# Altium schematic sheet 1-2199298-2.SchDoc
size A; SheetNumber: 1; SheetTotal: 1
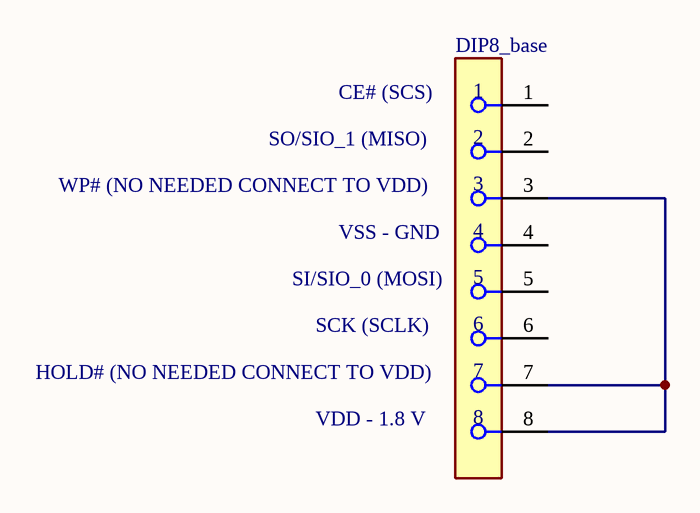
[diagram p0: 1-2199298-2.SchDoc]

## Parts
DIP8_base  DIP8_base  [FP-1-2199298-2-MFG]  (value not drawn)

## Nets
NetDIP8_base_3: DIP8_base.3 DIP8_base.7 DIP8_base.8

Not connected (* = marked no-connect by the designer): DIP8_base 1 2 4 5 6

## Notes on the sheet
- WP# (NO NEEDED CONNECT TO VDD)
- (near DIP8_base) SO/SIO_1 (MISO)
- (near DIP8_base) CE# (SCS)
- (near DIP8_base) SI/SIO_0 (MOSI)
- (near DIP8_base) VSS - GND
- HOLD# (NO NEEDED CONNECT TO VDD)
- (near DIP8_base) VDD - 1.8 V
- (near DIP8_base) SCK (SCLK)

## Library data of the parts
DIP8_base = CMP-03370-000009-1: CONN IC DIP SOCKET 8POS TIN; Contact Post Length: 3inch; Number of Contacts: 8; Contact Current Rating: 1A; Contact Resistance: 20mR; Insulation Resistance: 1GR; Connector Type: Pin; Row Spacing: 0.3inch; Pitch: 2.54mm; Mating Alignment: Yes (With); RoHS Compliant: Yes; Packaging: Rail/Tube; Contact Material: Bronze; Lead Pitch: 2.54mm; Mount: Through Hole; Termination: Through Hole; Max Operating Temperature: 105°C; Flammability Rating: UL94 V-0; Package Quantity: 60; Contact Finish - Mating: TIN; ELV: Compliant; Radiation Hardening: No; Number of Rows: 2; Series: Diplomate DL; Color: Black; Number of Positions: 8; Contact Plating: Tin; Min Operating Temperature: -40°C; Lead Free: Lead Free; Length: 0.4inch; Orientation: Straight; Housing Material: PBT